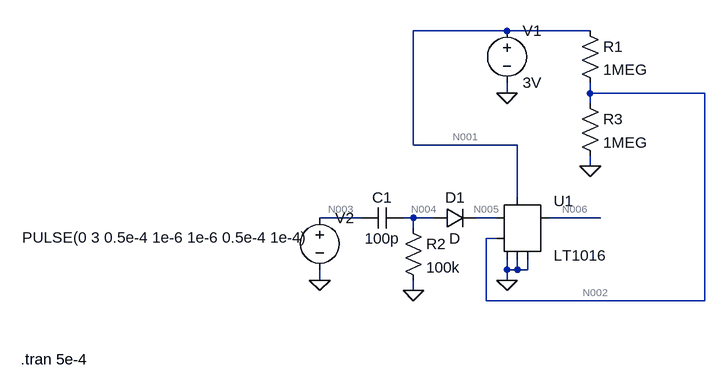
[diagram p0: schematic comparator_as_monostable.asc]
comparator_as_monostable.asc, the LTspice schematic file:
Version 4
SHEET 1 880 680
WIRE 224 -96 80 -96
WIRE 352 -96 224 -96
WIRE 224 0 224 -16
WIRE 352 0 352 -16
WIRE 528 0 352 0
WIRE 352 16 352 0
WIRE 80 80 80 -96
WIRE 240 80 80 80
WIRE 352 112 352 96
WIRE 240 160 240 80
WIRE 0 192 -64 192
WIRE 80 192 64 192
WIRE 112 192 80 192
WIRE 208 192 176 192
WIRE 368 192 288 192
WIRE 80 208 80 192
WIRE 208 224 192 224
WIRE 224 272 224 256
WIRE 240 272 240 256
WIRE 240 272 224 272
WIRE 256 272 256 256
WIRE 256 272 240 272
WIRE -64 288 -64 272
WIRE 224 288 224 272
WIRE 80 304 80 288
WIRE 192 320 192 224
WIRE 528 320 528 0
WIRE 528 320 192 320
FLAG 224 288 0
FLAG -64 288 0
FLAG 224 0 0
FLAG 80 304 0
FLAG 352 112 0
SYMBOL Comparators\\LT1016 240 144 R0
SYMATTR InstName U1
SYMBOL voltage 224 -112 R0
WINDOW 123 0 0 Left 2
WINDOW 39 0 0 Left 2
SYMATTR InstName V1
SYMATTR Value 3V
SYMBOL voltage -64 176 R0
WINDOW 3 -458 46 Left 2
WINDOW 123 0 0 Left 2
WINDOW 39 0 0 Left 2
SYMATTR InstName V2
SYMATTR Value PULSE(0 3 0.5e-4 1e-6 1e-6 0.5e-4 1e-4)
SYMBOL cap 64 176 R90
WINDOW 0 0 32 VBottom 2
WINDOW 3 32 32 VTop 2
SYMATTR InstName C1
SYMATTR Value 100p
SYMBOL res 64 192 R0
SYMATTR InstName R2
SYMATTR Value 100k
SYMBOL diode 112 208 R270
WINDOW 0 32 32 VTop 2
WINDOW 3 0 32 VBottom 2
SYMATTR InstName D1
SYMBOL res 336 -112 R0
SYMATTR InstName R1
SYMATTR Value 1MEG
SYMBOL res 336 0 R0
SYMATTR InstName R3
SYMATTR Value 1MEG
TEXT -524 410 Left 2 !.tran 5e-4

The netlist it stands for:
* comparator_as_monostable.asc
XU1 N001 N002 N005 0 0 0 N006 NC_01 LT1016
V1 N001 0 3V
V2 N003 0 PULSE(0 3 0.5e-4 1e-6 1e-6 0.5e-4 1e-4)
C1 N004 N003 100p
R2 N004 0 100k
D1 N004 N005 D
R1 N001 N002 1MEG
R3 N002 0 1MEG
.model D D
.lib standard.dio
.tran 5e-4
.lib LTC.lib
.backanno
.end

* Results of the author's LTspice run, read from the files saved beside the schematic
* Operating Point, zero values left out:
*   V(n001) = 3 V
*   V(n006) = 2.992 V
*   V(n005) = 1.043 V
*   V(n002) = 1.043 V
*   V(n004) = 105.3 nV
*   I(D1) = -1.053 pA
*   I(R3) = 1.043 µA
*   I(R1) = 1.957 µA
*   I(R2) = 1.053 pA
*   I(V1) = -20.78 mA
*   Ix(u1:1) = 20.78 mA
*   Ix(u1:2) = 913.4 nA
*   Ix(u1:3) = -1.053 pA
*   Ix(u1:4) = -3.002 mA
*   Ix(u1:5) = -499.7 µA
*   Ix(u1:6) = -17.28 mA
*   Ix(u1:7) = -2.984 pA
*   Ix(u1:8) = 2.708 pA
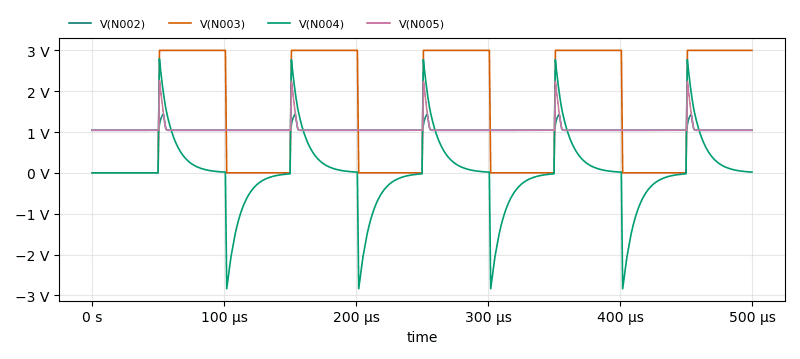
[diagram p1: Transient Analysis of comparator_as_monostable.asc, plotted from the saved traces]
* Transient Analysis, 1 run:
*   V(N002): min 1.043 V, max 1.443 V, average 1.057 V, rms 1.058 V, last 1.043 V
*   V(N003): min 0 V, max 3 V, average 1.521 V, rms 2.13 V, last 3 V
*   V(N004): min -2.84 V, max 2.791 V, average 34.09 mV, rms 853.1 mV, last 18.89 mV
*   V(N005): min 1.043 V, max 2.26 V, average 1.074 V, rms 1.084 V, last 1.043 V